# Altium schematic sheet 05.SchDoc
size 297 x 209 mm
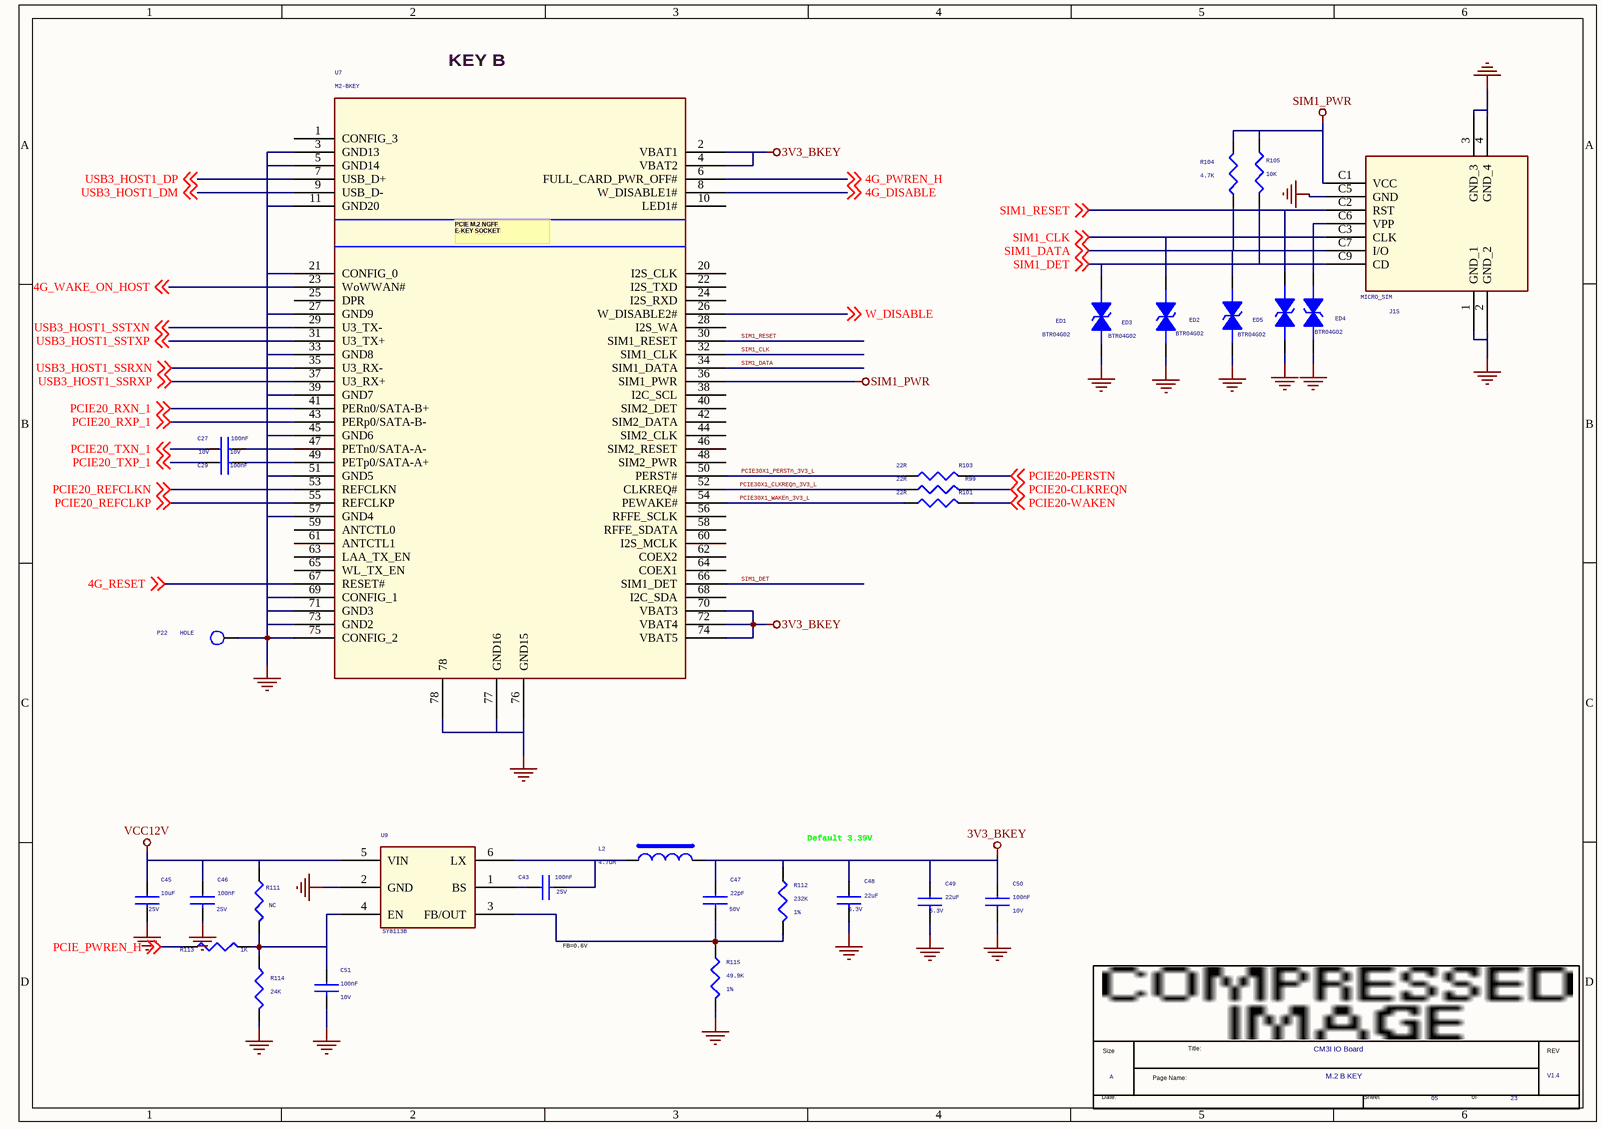
[diagram p0: 05.SchDoc]

## Parts
*  Page Count: 23  Page Number: 05  Page Size: A  Title: CM3I IO Board  RevCode: V1.4  Doc: M.2 B KEY  (hidden comment: radxa_1010)  (graphical)
C27  100nF  Voltage: 10V  [C0402]
C29  100nF  Voltage: 10V  [C0402]
C43  100nF  Voltage: 25V  [C0402]
C45  10uF  Voltage: 25V  [C1206]
C46  100nF  Voltage: 25V  [C0402]
C47  22pF  Voltage: 50V  [C0402]
C48  22uF  Voltage: 6.3V  [C0603]
C49  22uF  Voltage: 6.3V  [C0603]
C50  100nF  Voltage: 10V  [C0402]
C51  100nF  Voltage: 10V  [C0402]
ED1  BTR04G02  [ESD0402_1xD5]
ED2  BTR04G02  [ESD0402_1xD5]
ED3  BTR04G02  [ESD0402_1xD5]
ED4  BTR04G02  [ESD0402_1xD5]
ED5  BTR04G02  [ESD0402_1xD5]
J15  MICRO_SIM  [SIM-SPPN08-X0-1X80]
L2  4.7uH  [IND-4X4]
P22  HOLE  [TEST]
R99  22R  [R0402]
R101  22R  [R0402]
R103  22R  [R0402]
R104  4.7K  [R0402]
R105  10K  [R0402]
R111  NC  [R0402]
R112  232K  Tolerance: 1%  [R0402]
R113  1K  [R0402]
R114  24K  [R0402]
R115  49.9K  Tolerance: 1%  [R0402]
U7  M2-BKEY  [M2_NGFF_KEY_B-GX]
U9  SY8113B  [SOT_23_6]

## Nets
3V3_BKEY: C47.1 C48.1 C49.1 C50.1 L2.2 R112.1 U7.2(VBAT1) U7.4(VBAT2) U7.70(VBAT3) U7.72(VBAT4) U7.74(VBAT5)
GND: C45.2 C46.2 C48.2 C49.2 C50.2 C51.2 ED1.2 ED2.2 ED3.2 ED4.2 ED5.2 J15.1(GND_1) J15.2(GND_2) J15.3(GND_3) J15.4(GND_4) J15.C5(GND) P22.1 R114.2 R115.2 U7.3(GND13) U7.5(GND14) U7.11(GND20) U7.21(CONFIG_0) U7.27(GND9) U7.33(GND8) U7.39(GND7) U7.45(GND6) U7.51(GND5) U7.57(GND4) U7.69(CONFIG_1) U7.71(GND3) U7.73(GND2) U7.75(CONFIG_2) U7.76(GND15) U7.77(GND16) U7.78 U9.2(GND)
SIM1_PWR: J15.C1(VCC) R104.1 R105.1 U7.36(SIM1_PWR)
VCC12V: C45.1 C46.1 R111.1 U9.5(VIN)
4G_DISABLE: U7.8(W_DISABLE1#) ; off-sheet 4G_DISABLE
4G_PWREN_H: U7.6(FULL_CARD_PWR_OFF#) ; off-sheet 4G_PWREN_H
4G_RESET: U7.67(RESET#) ; off-sheet 4G_RESET
4G_WAKE_ON_HOST: U7.23(WoWWAN#) ; off-sheet 4G_WAKE_ON_HOST
PCIE20-CLKREQN: R99.1 ; off-sheet PCIE20-CLKREQN
PCIE20-PERSTN: R103.1 ; off-sheet PCIE20-PERSTN
PCIE20-WAKEN: R101.1 ; off-sheet PCIE20-WAKEN
PCIE20_REFCLKN: U7.53(REFCLKN) ; off-sheet PCIE20_REFCLKN
PCIE20_REFCLKP: U7.55(REFCLKP) ; off-sheet PCIE20_REFCLKP
PCIE20_RXN_1: U7.41(PERn0/SATA-B+) ; off-sheet PCIE20_RXN_1
PCIE20_RXP_1: U7.43(PERp0/SATA-B-) ; off-sheet PCIE20_RXP_1
PCIE20_TXN_1: C27.1 ; off-sheet PCIE20_TXN_1
PCIE20_TXP_1: C29.1 ; off-sheet PCIE20_TXP_1
PCIE30X1_CLKREQn_3V3_L: R99.2 U7.52(CLKREQ#)
PCIE30X1_PERSTn_3V3_L: R103.2 U7.50(PERST#)
PCIE30X1_WAKEn_3V3_L: R101.2 U7.54(PEWAKE#)
PCIE_PWREN_H: R113.1 ; off-sheet PCIE_PWREN_H
SIM1_CLK: ED3.1 J15.C3(CLK) U7.32(SIM1_CLK) ; off-sheet SIM1_CLK
SIM1_DATA: ED2.1 J15.C7(I/O) R104.2 U7.34(SIM1_DATA) ; off-sheet SIM1_DATA
SIM1_DET: ED1.1 J15.C9(CD) R105.2 U7.66(SIM1_DET) ; off-sheet SIM1_DET
SIM1_RESET: ED5.1 J15.C2(RST) U7.30(SIM1_RESET) ; off-sheet SIM1_RESET
USB3_HOST1_DM: U7.9(USB_D-) ; off-sheet USB3_HOST1_DM
USB3_HOST1_DP: U7.7(USB_D+) ; off-sheet USB3_HOST1_DP
USB3_HOST1_SSRXN: U7.35(U3_RX-) ; off-sheet USB3_HOST1_SSRXN
USB3_HOST1_SSRXP: U7.37(U3_RX+) ; off-sheet USB3_HOST1_SSRXP
USB3_HOST1_SSTXN: U7.29(U3_TX-) ; off-sheet USB3_HOST1_SSTXN
USB3_HOST1_SSTXP: U7.31(U3_TX+) ; off-sheet USB3_HOST1_SSTXP
W_DISABLE: U7.26(W_DISABLE2#) ; off-sheet W_DISABLE
NetC27_2: C27.2 U7.47(PETn0/SATA-A-)
NetC29_2: C29.2 U7.49(PETp0/SATA-A+)
NetC43_1: C43.1 U9.1(BS)
NetC43_2: C43.2 L2.1 U9.6(LX)
NetC47_2: C47.2 R112.2 R115.1 U9.3(FB/OUT)
NetC51_1: C51.1 R111.2 R113.2 R114.1 U9.4(EN)
NetED4_1: ED4.1 J15.C6(VPP)

Not connected (* = marked no-connect by the designer): U7 1(CONFIG_3) 10(LED1#) 20(I2S_CLK) 22(I2S_TXD) 24(I2S_RXD) 25(DPR) 28(I2S_WA) 38(I2C_SCL) 40(SIM2_DET) 42(SIM2_DATA) 44(SIM2_CLK) 46(SIM2_RESET) 48(SIM2_PWR) 56(RFFE_SCLK) 58(RFFE_SDATA) 59(ANTCTL0) 60(I2S_MCLK) 61(ANTCTL1) 62(COEX2) 63(LAA_TX_EN) 64(COEX1) 65(WL_TX_EN) 68(I2C_SDA)

## Notes on the sheet
- KEY B
- Default 3.39V
- FB=0.6V
- (in symbol M_6.2 NGFF EKEY SOCKET) PCIE M.2 NGFF / E-KEY SOCKET
- (in symbol radxa_1010) Size; Title:; REV; Page Name:; Date:; Sheet; of

## Library data of the parts
C27 = CAP NP_0: cap,100.00nF,+/-10%,10V,X5R,C0201; Manufacturer PN: C0603X5R1A104K030BC; Manufacturer: TDK; Tolerance: 10%; Priority: A; Dielectric: X5R; Created by: JJJ; Part Type: C0201; RK PN: C0603X5R1A104K030BC
C29 = CAP NP_0: cap,100.00nF,+/-10%,10V,X5R,C0201; Manufacturer: TDK; RK PN: C0603X5R1A104K030BC; Priority: A; Tolerance: 10%; Dielectric: X5R; Part Type: C0201; Manufacturer PN: C0603X5R1A104K030BC; Created by: JJJ
C43 = CAP NP_0: cap,100.00nF,+/-10%,25V,X5R,C0402; Manufacturer: TDK; Number: 37; RK PN: C1005X5R1E104K050BC; Priority: A; Tolerance: 10%; C_Voltage: 6.3V; Dielectric: X5R; Part Type: C0402; Manufacturer PN: C1005X5R1E104K050BC; Created by: JJJ
C45 = CAP NP_0: cap,10.00uF,+/-10%,25V,X5R,C1206; Manufacturer: TDK; RK PN: C3216X5R1E106K085AC; Priority: A; C_Voltage: 6.3V; Tolerance: 10%; Dielectric: X5R; Part Type: C1206; Manufacturer PN: C3216X5R1E106K085AC; Created by: JJJ
C46 = CAP NP_0: cap,100.00nF,+/-10%,25V,X5R,C0402; Manufacturer: TDK; RK PN: C1005X5R1E104K050BC; Priority: A; Tolerance: 10%; Dielectric: X5R; Part Type: C0402; Manufacturer PN: C1005X5R1E104K050BC; Created by: JJJ
C47 = CAP NP_0: cap,22.00pF,+/-5%,50V,C0G,C0402; Manufacturer: TDK; RK PN: C1005C0G1H220J050BA; Priority: A; Tolerance: 5%; Dielectric: C0G; Part Type: C0402; Manufacturer PN: C1005C0G1H220J050BA; Created by: JJJ
C48 C49 = CAP NP_0: cap,22.00uF,+/-10%,10V,X5R,C0805; Manufacturer PN: C2012X5R1A226K125AB; Manufacturer: TDK; Tolerance: 10%; Priority: A; Dielectric: X5R; Created by: JJJ; C_Voltage: 6.3V; Part Type: C0805; RK PN: C2012X5R1A226K125AB
C50 = CAP NP_0: cap,100.00nF,+/-10%,10V,X5R,C0402; Manufacturer PN: C1005X5R1A104K050BA; Manufacturer: TDK; C_Voltage: 6.3V; Tolerance: 10%; Priority: A; Number: 37; Dielectric: X5R; Created by: JJJ; Part Type: C0402; RK PN: C1005X5R1A104K050BA
C51 = CAP NP_0: cap,100.00nF,+/-10%,10V,X5R,C0402; Manufacturer: TDK; Number: 37; RK PN: C1005X5R1A104K050BA; Priority: A; Tolerance: 10%; C_Voltage: 6.3V; Dielectric: X5R; Part Type: C0402; Manufacturer PN: C1005X5R1A104K050BA; Created by: JJJ
ED1-ED5 = DIODE BI_DIR TRIG_0: 1-Line, Bi-directional, Transient Voltage Suppressors.17.5pF.; Manufacturer PN: ESD5451N; Manufacturer: WillSemi(韦尔半导体); Priority: A; Created by: JJJ; Part Type: ESD_TVS; RK PN: ESD5451N
J15 = SIM-SPPN08-X0-1X80_0: SIM Card Connector,9pin,SMT
L2 = INDUCTORS OF FERRITE_Dup1: Power Inductor,4.7uH,0.2,IND_606045; Manufacturer PN: SWPA6045S4R7MT; Manufacturer: sunlord; DC Resistor: 0.02ohm; Isat: 4.97A; Resonace frequency: 24M; Irms: 3.3A; Tolerance: 20%; Priority: A; Created by: YWQ; Part Type: POWER_IND; RK PN: SWPA6045S4R7MT
P22 = TESTPOINT1
R99 R103 = RESISTOR_0_Dup1: 通用厚膜电阻,22R,+/-5%,R0402,1/16W.; Manufacturer: YAGEO; Tolerance: 5%; RK PN: RC0402JR-0722RL; Priority: A; Wattage: 1/16W; Part Type: 通用厚膜电阻; Manufacturer PN: RC0402JR-0722RL; Created by: YTL
R101 = RESISTOR_0_Dup1: 通用厚膜电阻,22R,+/-5%,R0402,1/16W.; Manufacturer PN: RC0402JR-0722RL; Manufacturer: YAGEO; Tolerance: 5%; Wattage: 1/16W; Priority: A; Created by: YTL; Part Type: 通用厚膜电阻; RK PN: RC0402JR-0722RL
R104 R105 = RESISTOR_0_Dup1: 通用厚膜电阻,4K7,+/-5%,R0402,1/16W.; Manufacturer: YAGEO; Tolerance: 5%; RK PN: RC0402JR-074K7L; Priority: A; Wattage: 1/16W; Part Type: 通用厚膜电阻; Manufacturer PN: RC0402JR-074K7L; Created by: YTL
R111 = RESISTOR_0_Dup1: 通用厚膜电阻,24K,+/-5%,R0402,1/16W.; Manufacturer PN: RC0402JR-0724KL; Manufacturer: YAGEO; Tolerance: 5%; Wattage: 1/16W; Priority: A; Created by: YTL; Part Type: 通用厚膜电阻; RK PN: RC0402JR-0724KL
R112 = RESISTOR_0_Dup1: 通用厚膜电阻,232K,+/-1%,R0402,1/16W.; Manufacturer PN: RC0402FR-07232KL; Manufacturer: YAGEO; Wattage: 1/16W; Priority: A; Created by: YTL; Part Type: 通用厚膜电阻; RK PN: RC0402FR-07232KL
R113 = RESISTOR_0_Dup1: 通用厚膜电阻,100K,+/-5%,R0402,1/16W.; Manufacturer PN: RC0402JR-07100KL; Manufacturer: YAGEO; Tolerance: 5%; Wattage: 1/16W; Priority: A; Created by: YTL; Part Type: 通用厚膜电阻; RK PN: RC0402JR-07100KL
R114 = RESISTOR_0_Dup1: 通用厚膜电阻,24K,+/-5%,R0402,1/16W.; Manufacturer: YAGEO; Tolerance: 5%; RK PN: RC0402JR-0724KL; Priority: A; Wattage: 1/16W; Part Type: 通用厚膜电阻; Manufacturer PN: RC0402JR-0724KL; Created by: YTL
R115 = RESISTOR_0_Dup1: 通用厚膜电阻,49K9,+/-1%,R0402,1/16W.; Manufacturer: YAGEO; RK PN: RC0402FR-0749K9L; Priority: A; Wattage: 1/16W; Part Type: 通用厚膜电阻; Manufacturer PN: RC0402FR-0749K9L; Created by: YTL
U7 = M_6.2 NGFF EKEY SOCKET
U9 = DCDC_SY8113: Manufacturer: Silergy（矽力杰）; Priority: A; Created by: JJJ; Manufacturer PN: SY8113B; Part Type: DCDC; RK PN: SY8113B
* = radxa_1010: Page Create Date: March  8, 1995